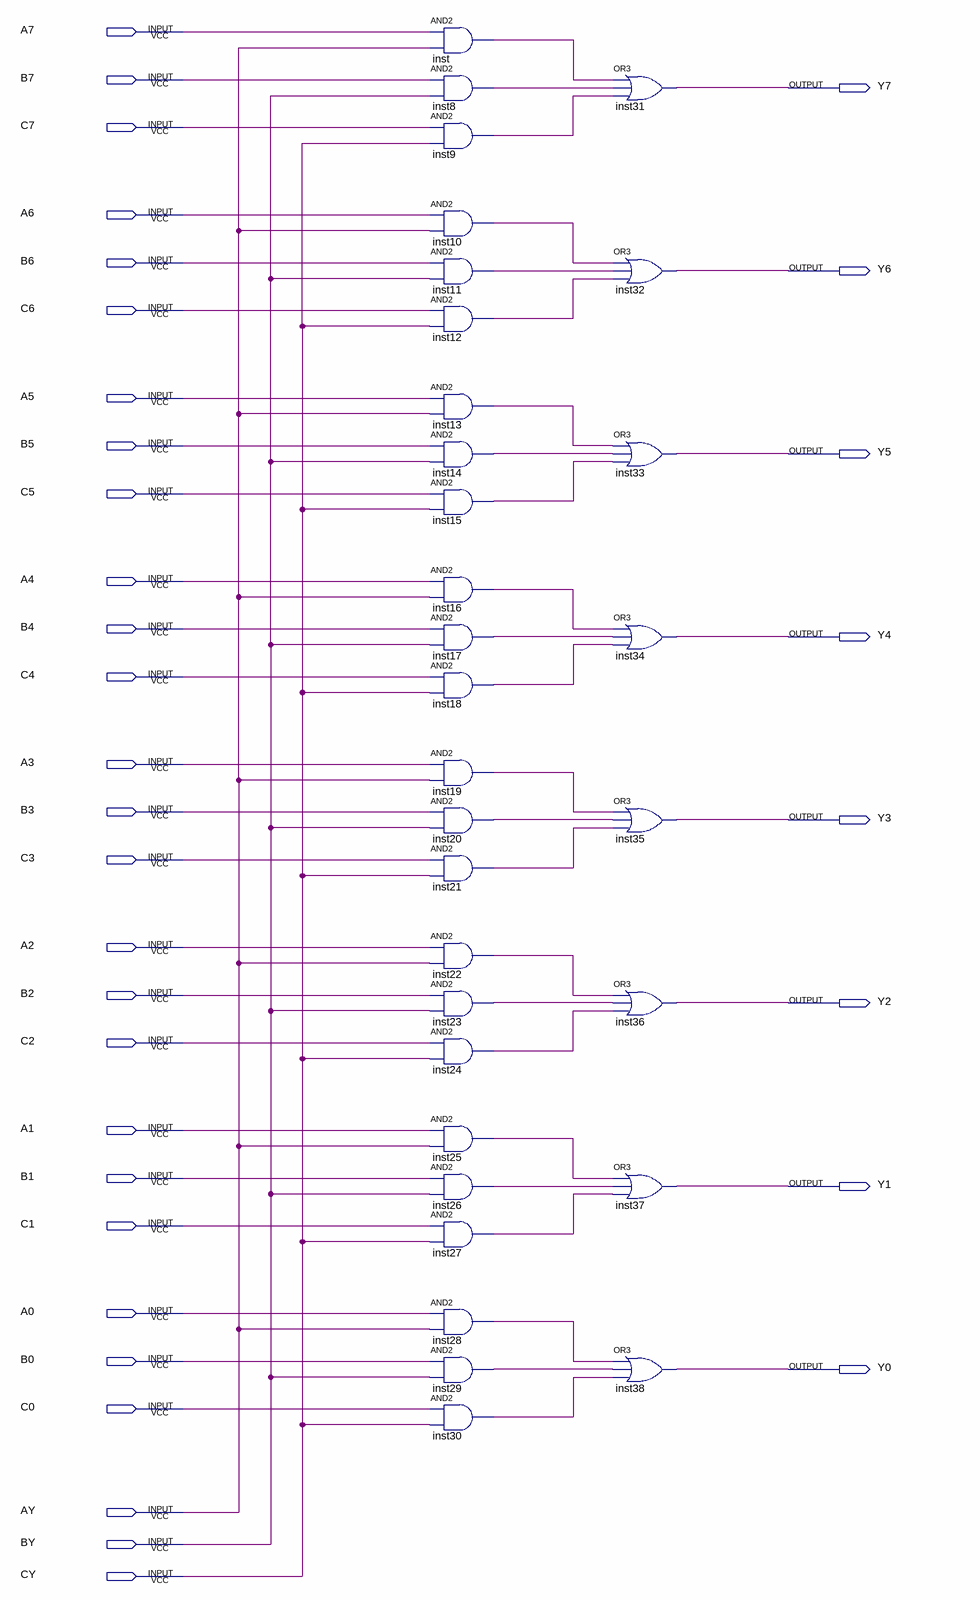
[diagram p0: schematic sheet]
// Quartus schematic mux3-8.bdf as structural Verilog: 32 symbols, 35 pins
module \mux3-8  (
  input  A7,
  input  B7,
  input  C7,
  input  A6,
  input  B6,
  input  C6,
  input  A5,
  input  B5,
  input  C5,
  input  A4,
  input  B4,
  input  C4,
  input  A3,
  input  B3,
  input  C3,
  input  A2,
  input  B2,
  input  C2,
  input  A1,
  input  B1,
  input  C1,
  input  A0,
  input  B0,
  input  C0,
  input  AY,
  input  BY,
  input  CY,
  output Y7,
  output Y6,
  output Y5,
  output Y4,
  output Y3,
  output Y2,
  output Y1,
  output Y0
);

  wire inst8_out, inst9_out, inst10_out, inst11_out, inst12_out, inst13_out, inst14_out, inst15_out,
       inst16_out, inst17_out, inst18_out, inst19_out, inst20_out, inst21_out, inst22_out, inst23_out,
       inst24_out, inst25_out, inst26_out, inst27_out, inst28_out, inst29_out, inst30_out, inst_out;

  and inst (inst_out, A7, AY);
  and inst8 (inst8_out, B7, BY);
  and inst9 (inst9_out, C7, CY);
  and inst10 (inst10_out, A6, AY);
  and inst11 (inst11_out, B6, BY);
  and inst12 (inst12_out, C6, CY);
  and inst13 (inst13_out, A5, AY);
  and inst14 (inst14_out, B5, BY);
  and inst15 (inst15_out, C5, CY);
  and inst16 (inst16_out, A4, AY);
  and inst17 (inst17_out, B4, BY);
  and inst18 (inst18_out, C4, CY);
  and inst19 (inst19_out, A3, AY);
  and inst20 (inst20_out, B3, BY);
  and inst21 (inst21_out, C3, CY);
  and inst22 (inst22_out, A2, AY);
  and inst23 (inst23_out, B2, BY);
  and inst24 (inst24_out, C2, CY);
  and inst25 (inst25_out, A1, AY);
  and inst26 (inst26_out, B1, BY);
  and inst27 (inst27_out, C1, CY);
  and inst28 (inst28_out, A0, AY);
  and inst29 (inst29_out, B0, BY);
  and inst30 (inst30_out, C0, CY);
  or inst31 (Y7, inst_out, inst8_out, inst9_out);
  or inst32 (Y6, inst10_out, inst11_out, inst12_out);
  or inst33 (Y5, inst13_out, inst14_out, inst15_out);
  or inst34 (Y4, inst16_out, inst17_out, inst18_out);
  or inst35 (Y3, inst19_out, inst20_out, inst21_out);
  or inst36 (Y2, inst22_out, inst23_out, inst24_out);
  or inst37 (Y1, inst25_out, inst26_out, inst27_out);
  or inst38 (Y0, inst28_out, inst29_out, inst30_out);
endmodule
